# EAGLE schematic v2nixie (EAGLE 9.6.2)
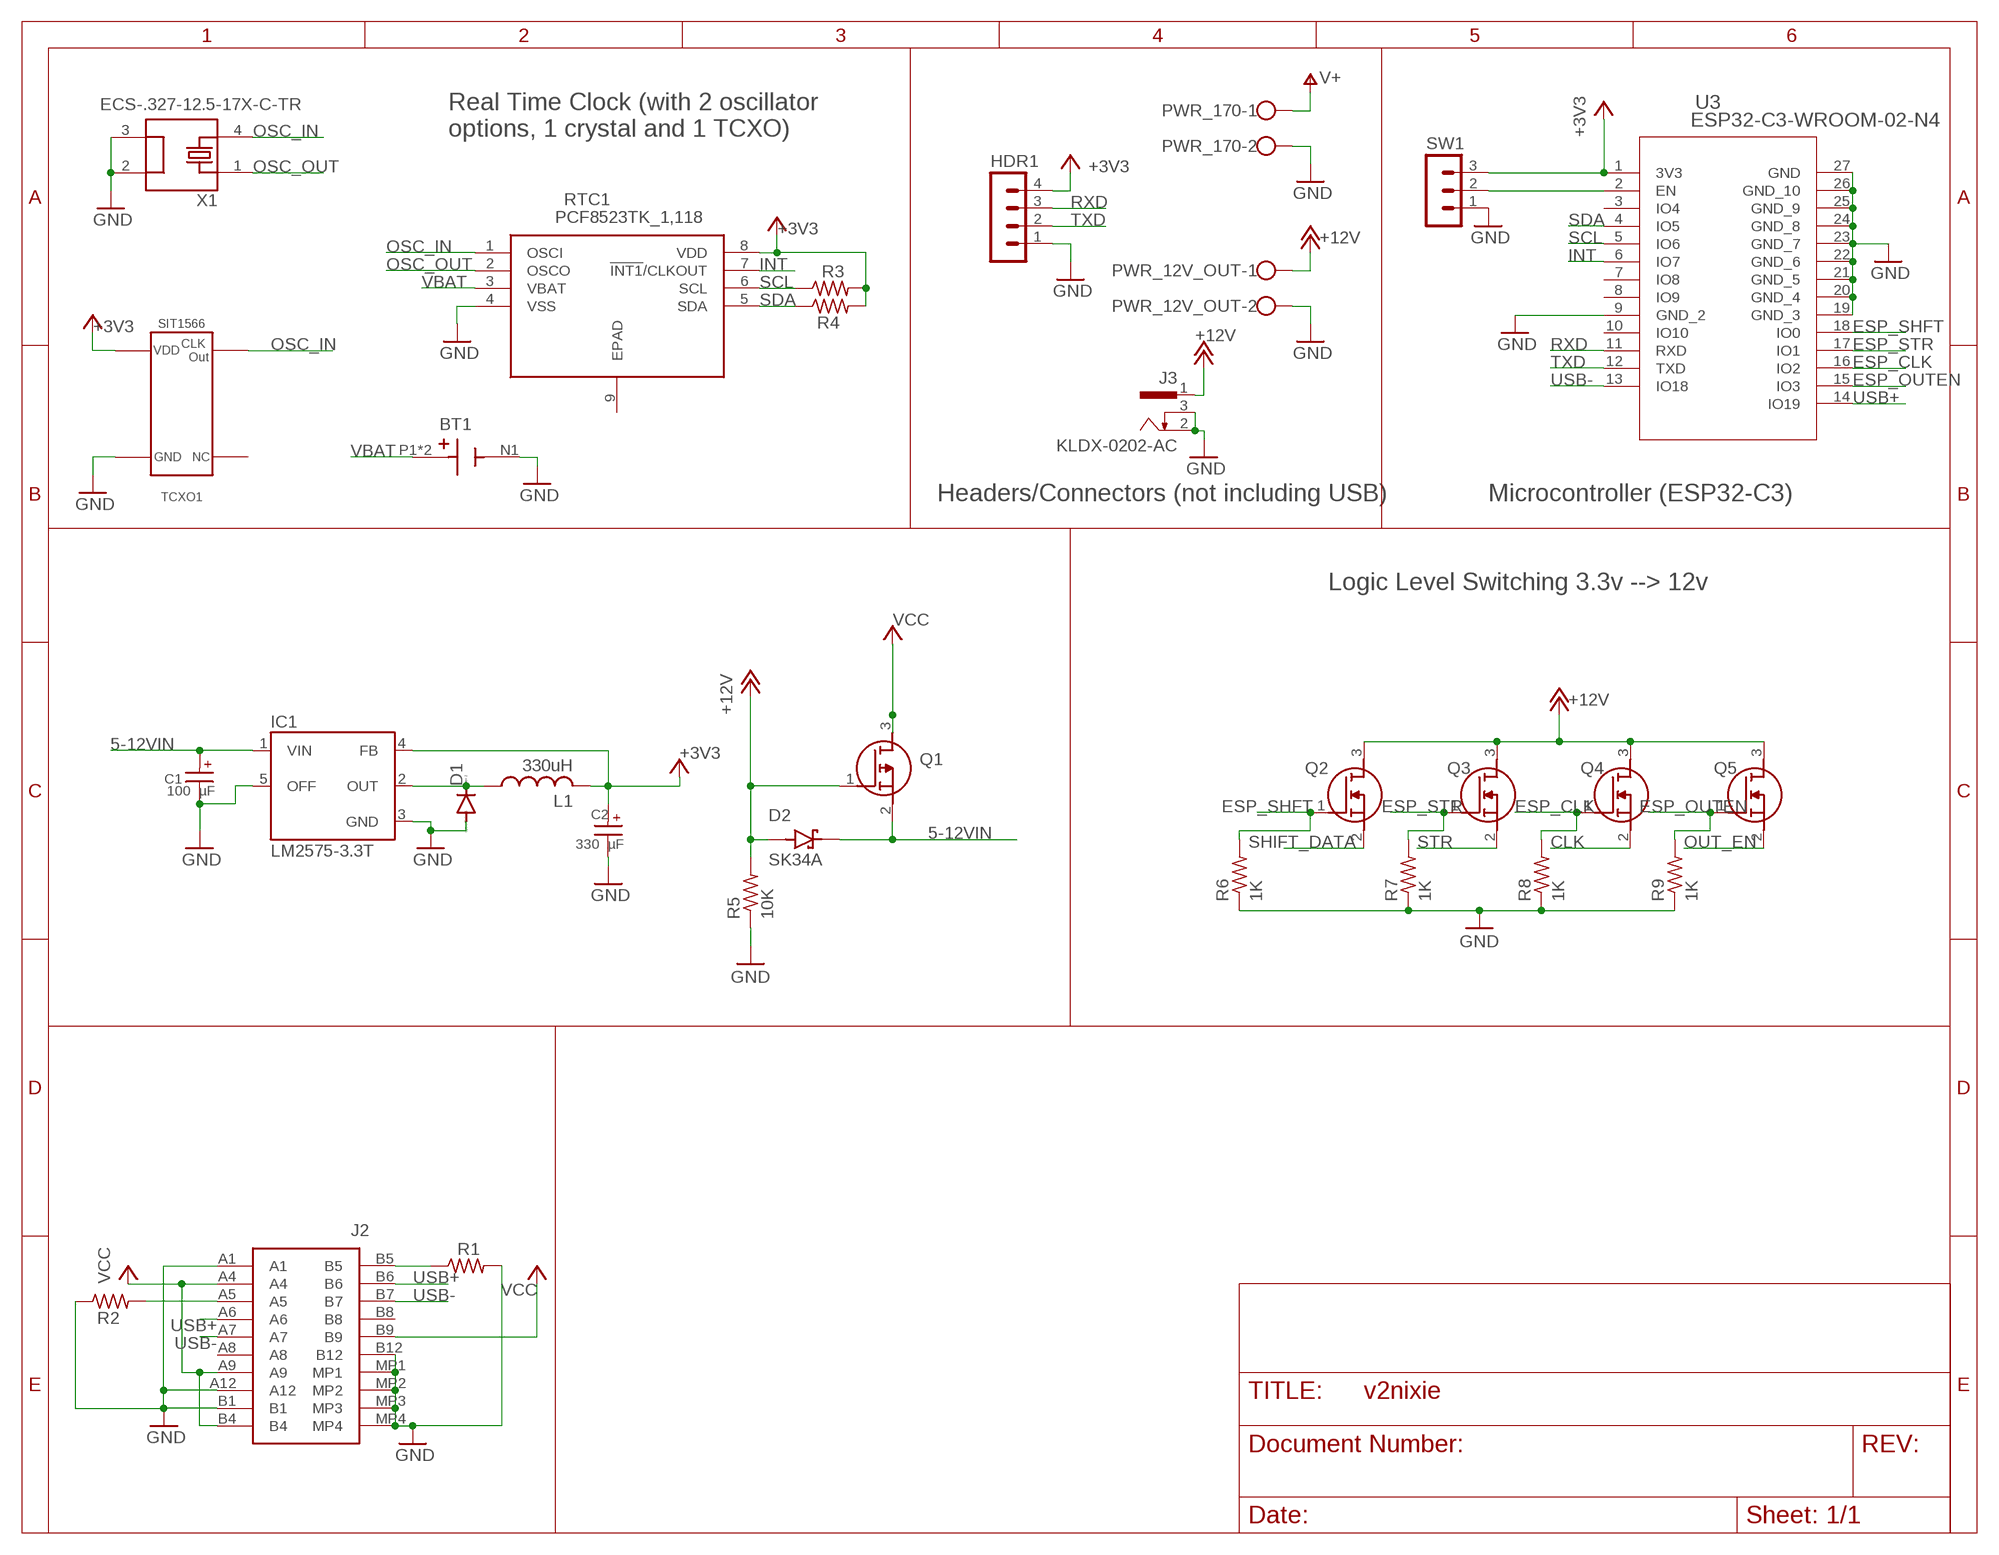
[diagram p0: schematic, sheet 1, part 1 of 2]
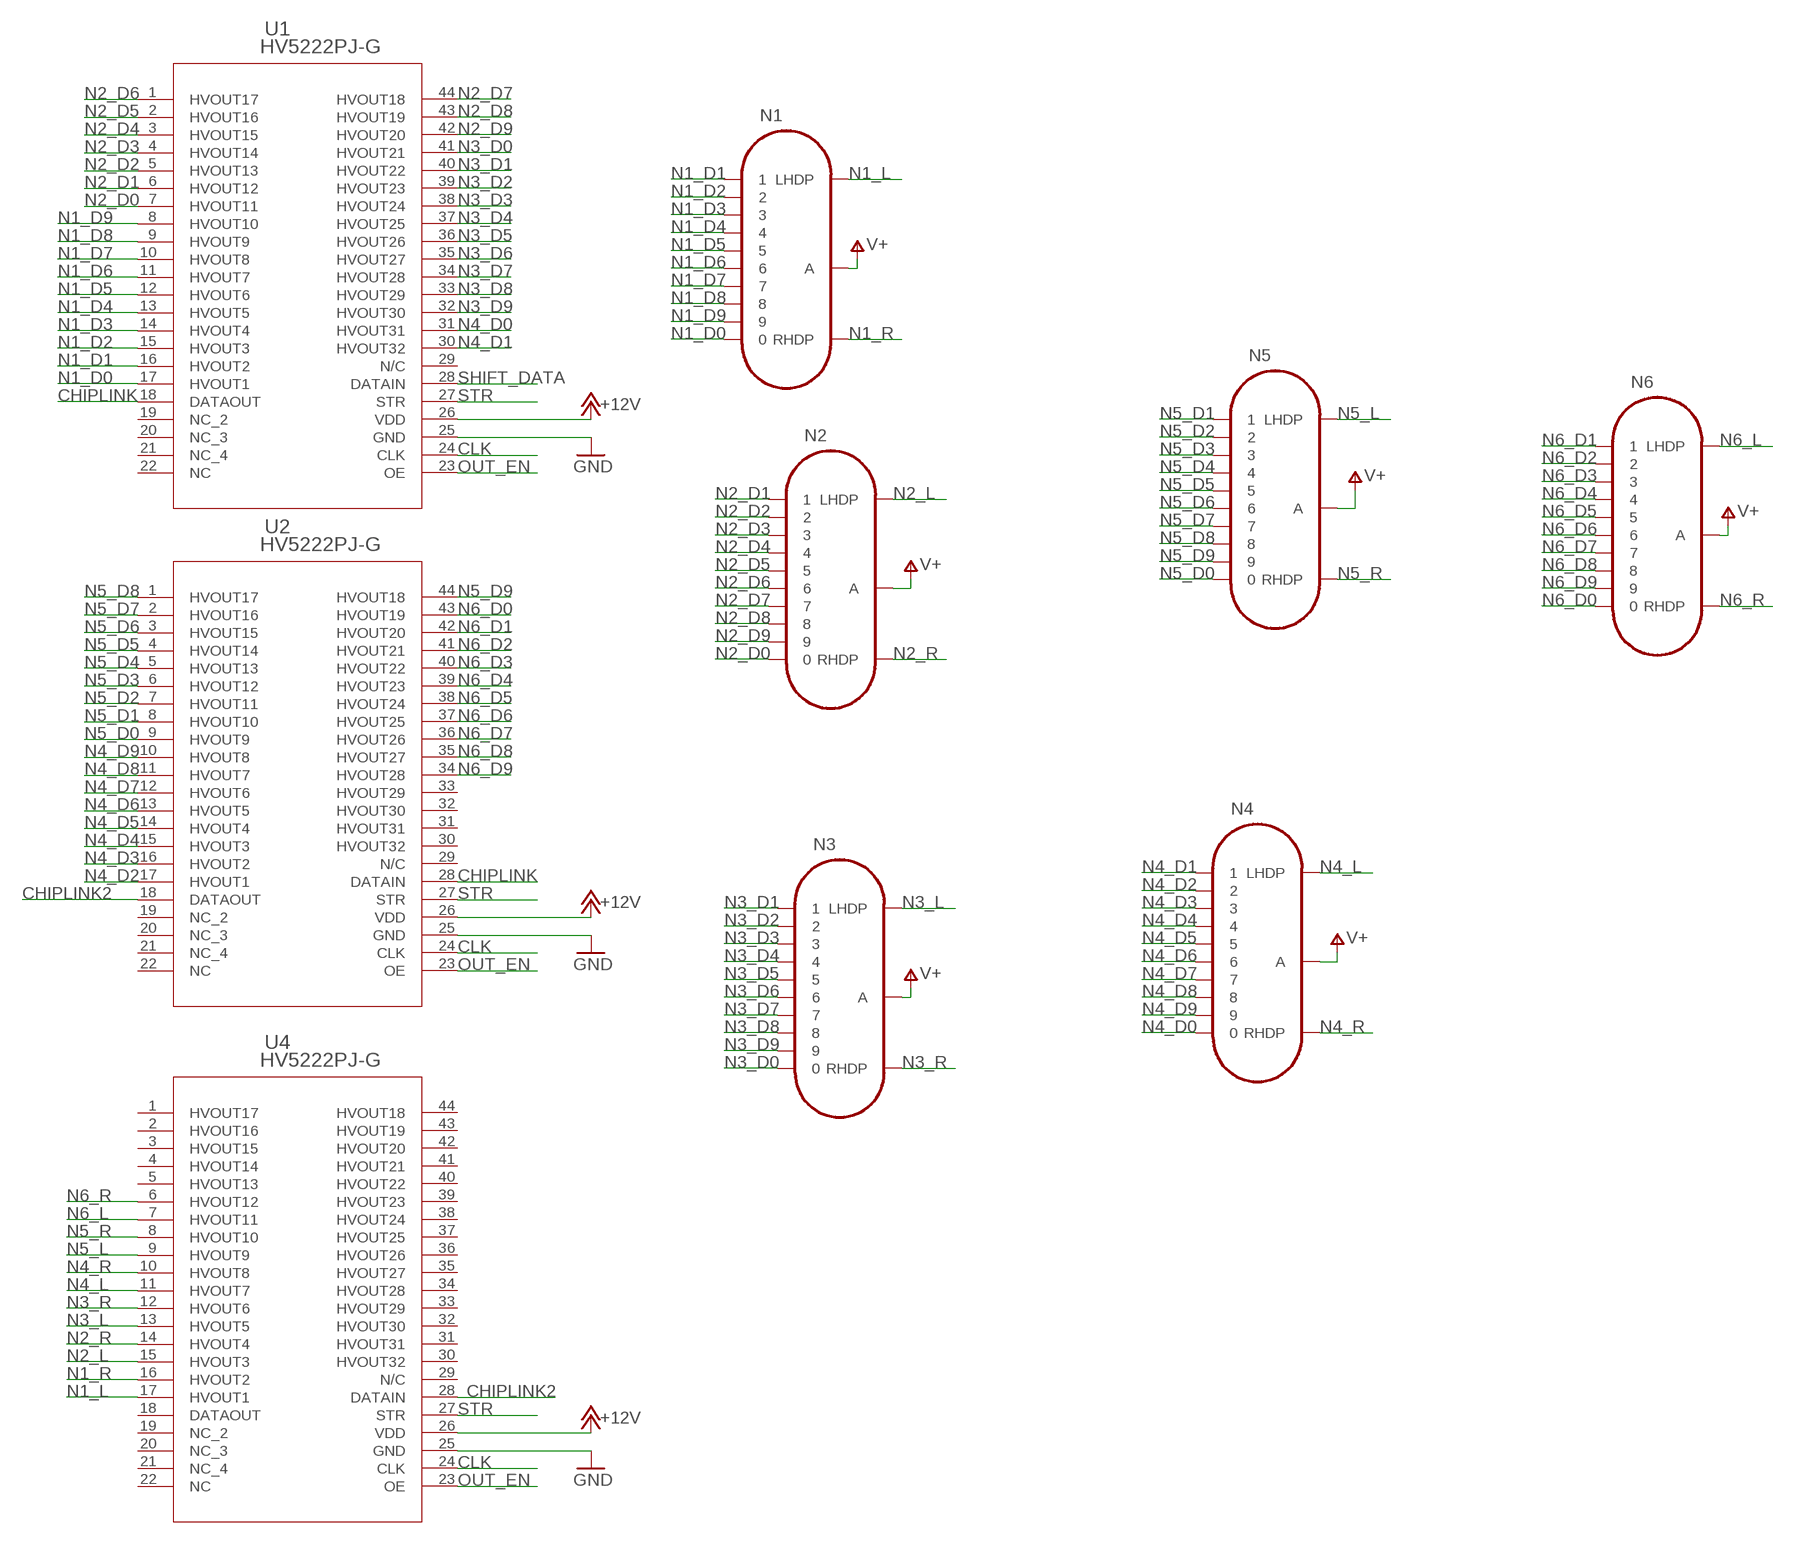
[diagram p1: schematic, sheet 1, part 2 of 2]

## Parts
BT1  BAT-HLD-001-TR  [BAT_BAT-HLD-001-TR]
C1  100 µF  WCAP-PTG5_8X11.5_870025374001  [WCAP-PTG5_8X11.5(DXL)]
C2  330 µF  WCAP-PTG5_8X8_870025174004  [WCAP-PTG5_8X8(DXL)]
D1  DIODE-DO201-15  [DO201-15]
D2  SK34A  [DIOM4325X250N]
HDR1  MA04-1  [MA04-1]
IC1  LM2575-3.3T  [TO220-5]
J2  USB4110-GF-A  [USB4110GFA]
J3  KLDX-0202-AC  [KYCON_KLDX-0202-AC]
L1  330uH  L-US6000-XXX-RC  [6000-XXXX-RC]
N1  IN-14  [IN-14]
N2  IN-14  [IN-14]
N3  IN-14  [IN-14]
N4  IN-14  [IN-14]
N5  IN-14  [IN-14]
N6  IN-14  [IN-14]
PWR_12V_OUT  W237-102  [W237-102]
PWR_170  W237-102  [W237-102]
Q1  SSM3J117TU,LF_T  [SSM3J117TULFT]
Q2  RU1J002YNTCL  [SOTFL65P210X105-3N]
Q3  RU1J002YNTCL  [SOTFL65P210X105-3N]
Q4  RU1J002YNTCL  [SOTFL65P210X105-3N]
Q5  RU1J002YNTCL  [SOTFL65P210X105-3N]
R1  5.1K  R-US_R0805  [R0805]
R2  5.1K  R-US_R0805  [R0805]
R3  10K  R-US_R0805  [R0805]
R4  10K  R-US_R0805  [R0805]
R5  10K  R-US_M0805  [M0805]
R6  1K  R-US_M0805  [M0805]
R7  1K  R-US_M0805  [M0805]
R8  1K  R-US_M0805  [M0805]
R9  1K  R-US_M0805  [M0805]
RTC1  PCF8523TK_1,118  [SON80P400X400X100-9N]
SW1  MA03-1  [MA03-1]
TCXO1  SIT1566  [SIT1566]
U1  HV5222PJ-G  [PLCC44_MC_MCH]
U2  HV5222PJ-G  [PLCC44_MC_MCH]
U3  ESP32-C3-WROOM-02-N4  [IC18_ESP32-C3-WROOM-02-N4_EXP]
U4  HV5222PJ-G  [PLCC44_MC_MCH]
X1  ECS-.327-12.5-17X-C-TR  [XTAL_ECS-.327-12.5-17X-C-TR]

## Nets
5-12VIN: C1.1(+) D2.C(K) IC1.1(VIN) Q1.2(S)
+3V3: C2.1(+) HDR1.4 IC1.4(FB) L1.2 R3.2 R4.2 RTC1.8(VDD) SW1.3 TCXO1.VDD U3.1(3V3)
+12V: D2.A J3.1 PWR_12V_OUT.1 Q1.1(G) Q2.3(D) Q3.3(D) Q4.3(D) Q5.3(D) R5.2 U1.26(VDD) U2.26(VDD) U4.26(VDD)
CHIPLINK: U1.18(DATAOUT) U2.28(DATAIN)
CHIPLINK2: U2.18(DATAOUT) U4.28(DATAIN)
CLK: Q4.2(S) U1.24(CLK) U2.24(CLK) U4.24(CLK)
ESP_CLK: Q4.1(G) R8.2 U3.16(IO2)
ESP_OUTEN: Q5.1(G) R9.2 U3.15(IO3)
ESP_SHFT: Q2.1(G) R6.2 U3.18(IO0)
ESP_STR: Q3.1(G) R7.2 U3.17(IO1)
GND: BT1.N1(-) C1.2(-) C2.2(-) D1.A HDR1.1 IC1.3(GND) IC1.5(OFF) J2.A1 J2.A12 J2.B1 J2.B12 J2.MP1 J2.MP2 J2.MP3 J2.MP4 J3.2 J3.3 PWR_12V_OUT.2 PWR_170.2 R1.2 R2.1 R5.1 R6.1 R7.1 R8.1 R9.1 RTC1.4(VSS) SW1.1 TCXO1.GND U1.25(GND) U2.25(GND) U3.9(GND_2) U3.19(GND_3) U3.20(GND_4) U3.21(GND_5) U3.22(GND_6) U3.23(GND_7) U3.24(GND_8) U3.25(GND_9) U3.26(GND_10) U3.27(GND) U4.25(GND) X1.2 X1.3
INT: RTC1.7(!INT1!/CLKOUT) U3.6(IO7)
N1_D0: N1.0 U1.17(HVOUT1)
N1_D1: N1.1 U1.16(HVOUT2)
N1_D2: N1.2 U1.15(HVOUT3)
N1_D3: N1.3 U1.14(HVOUT4)
N1_D4: N1.4 U1.13(HVOUT5)
N1_D5: N1.5 U1.12(HVOUT6)
N1_D6: N1.6 U1.11(HVOUT7)
N1_D7: N1.7 U1.10(HVOUT8)
N1_D8: N1.8 U1.9(HVOUT9)
N1_D9: N1.9 U1.8(HVOUT10)
N1_L: N1.LHDP U4.17(HVOUT1)
N1_R: N1.RHDP U4.16(HVOUT2)
N2_D0: N2.0 U1.7(HVOUT11)
N2_D1: N2.1 U1.6(HVOUT12)
N2_D2: N2.2 U1.5(HVOUT13)
N2_D3: N2.3 U1.4(HVOUT14)
N2_D4: N2.4 U1.3(HVOUT15)
N2_D5: N2.5 U1.2(HVOUT16)
N2_D6: N2.6 U1.1(HVOUT17)
N2_D7: N2.7 U1.44(HVOUT18)
N2_D8: N2.8 U1.43(HVOUT19)
N2_D9: N2.9 U1.42(HVOUT20)
N2_L: N2.LHDP U4.15(HVOUT3)
N2_R: N2.RHDP U4.14(HVOUT4)
N3_D0: N3.0 U1.41(HVOUT21)
N3_D1: N3.1 U1.40(HVOUT22)
N3_D2: N3.2 U1.39(HVOUT23)
N3_D3: N3.3 U1.38(HVOUT24)
N3_D4: N3.4 U1.37(HVOUT25)
N3_D5: N3.5 U1.36(HVOUT26)
N3_D6: N3.6 U1.35(HVOUT27)
N3_D7: N3.7 U1.34(HVOUT28)
N3_D8: N3.8 U1.33(HVOUT29)
N3_D9: N3.9 U1.32(HVOUT30)
N3_L: N3.LHDP U4.13(HVOUT5)
N3_R: N3.RHDP U4.12(HVOUT6)
N4_D0: N4.0 U1.31(HVOUT31)
N4_D1: N4.1 U1.30(HVOUT32)
N4_D2: N4.2 U2.17(HVOUT1)
N4_D3: N4.3 U2.16(HVOUT2)
N4_D4: N4.4 U2.15(HVOUT3)
N4_D5: N4.5 U2.14(HVOUT4)
N4_D6: N4.6 U2.13(HVOUT5)
N4_D7: N4.7 U2.12(HVOUT6)
N4_D8: N4.8 U2.11(HVOUT7)
N4_D9: N4.9 U2.10(HVOUT8)
N4_L: N4.LHDP U4.11(HVOUT7)
N4_R: N4.RHDP U4.10(HVOUT8)
N5_D0: N5.0 U2.9(HVOUT9)
N5_D1: N5.1 U2.8(HVOUT10)
N5_D2: N5.2 U2.7(HVOUT11)
N5_D3: N5.3 U2.6(HVOUT12)
N5_D4: N5.4 U2.5(HVOUT13)
N5_D5: N5.5 U2.4(HVOUT14)
N5_D6: N5.6 U2.3(HVOUT15)
N5_D7: N5.7 U2.2(HVOUT16)
N5_D8: N5.8 U2.1(HVOUT17)
N5_D9: N5.9 U2.44(HVOUT18)
N5_L: N5.LHDP U4.9(HVOUT9)
N5_R: N5.RHDP U4.8(HVOUT10)
N6_D0: N6.0 U2.43(HVOUT19)
N6_D1: N6.1 U2.42(HVOUT20)
N6_D2: N6.2 U2.41(HVOUT21)
N6_D3: N6.3 U2.40(HVOUT22)
N6_D4: N6.4 U2.39(HVOUT23)
N6_D5: N6.5 U2.38(HVOUT24)
N6_D6: N6.6 U2.37(HVOUT25)
N6_D7: N6.7 U2.36(HVOUT26)
N6_D8: N6.8 U2.35(HVOUT27)
N6_D9: N6.9 U2.34(HVOUT28)
N6_L: N6.LHDP U4.7(HVOUT11)
N6_R: N6.RHDP U4.6(HVOUT12)
N$1: J2.A5 R2.2
N$2: SW1.2 U3.2(EN)
N$3: J2.B5 R1.1
N$5: D1.C IC1.2(OUT) L1.1
OSC_IN: RTC1.1(OSCI) TCXO1.CLK_OUT X1.4
OSC_OUT: RTC1.2(OSCO) X1.1
OUT_EN: Q5.2(S) U1.23(OE) U2.23(OE) U4.23(OE)
RXD: HDR1.3 U3.11(RXD)
SCL: R3.1 RTC1.6(SCL) U3.5(IO6)
SDA: R4.1 RTC1.5(SDA) U3.4(IO5)
SHIFT_DATA: Q2.2(S) U1.28(DATAIN)
STR: Q3.2(S) U1.27(STR) U2.27(STR) U4.27(STR)
TXD: HDR1.2 U3.12(TXD)
USB+: J2.A6 J2.B6 U3.14(IO19)
USB-: J2.A7 J2.B7 U3.13(IO18)
V+: N1.A N2.A N3.A N4.A N5.A N6.A PWR_170.1
VBAT: BT1.P1(+) BT1.P2(+) RTC1.3(VBAT)
VCC: J2.A4 J2.A9 J2.B4 J2.B9 Q1.3(D)
Unconnected: J2.A8 J2.B8 RTC1.9(EPAD) TCXO1.NC U1.19(NC_2) U1.20(NC_3) U1.21(NC_4) U1.22(NC) U1.29(N/C) U2.19(NC_2) U2.20(NC_3) U2.21(NC_4) U2.22(NC) U2.29(N/C) U2.30(HVOUT32) U2.31(HVOUT31) U2.32(HVOUT30) U2.33(HVOUT29) U3.3(IO4) U3.7(IO8) U3.8(IO9) U3.10(IO10) U4.1(HVOUT17) U4.2(HVOUT16) U4.3(HVOUT15) U4.4(HVOUT14) U4.5(HVOUT13) U4.18(DATAOUT) U4.19(NC_2) U4.20(NC_3) U4.21(NC_4) U4.22(NC) U4.29(N/C) U4.30(HVOUT32) U4.31(HVOUT31) U4.32(HVOUT30) U4.33(HVOUT29) U4.34(HVOUT28) U4.35(HVOUT27) U4.36(HVOUT26) U4.37(HVOUT25) U4.38(HVOUT24) U4.39(HVOUT23) U4.40(HVOUT22) U4.41(HVOUT21) U4.42(HVOUT20) U4.43(HVOUT19) U4.44(HVOUT18)

## Notes on the sheet
- Real Time Clock (with 2 oscillator 
  options, 1 crystal and 1 TCXO)
- Headers/Connectors (not including USB) | Microcontroller (ESP32-C3)
- Logic Level Switching 3.3v --> 12v

## Library data of the parts
BT1 = BAT-HLD-001-TR:BAT-HLD-001-TR: Battery Retainer Coin, 20.0mm 1 Cell SMD (SMT) Tab; DESCRIPTION: Holder for CR2032 and CR2025 Batteries, Surface-Mount, Tape and Reel Packaging; DIGI-KEY_PART_NUMBER: BAT-HLD-001-TRTR-ND; MF: Linx Technologies; MP: BAT-HLD-001-TR; PACKAGE: None; PURCHASE-URL: https://pricing.snapeda.com/search/part/BAT-HLD-001-TR/?ref=eda
C1 = Wurth_Capacitors_WCAP-PTG5:WCAP-PTG5_8X11.5: WCAP-PTG5 Aluminium Polymer Capacitors General Purpose +105 °C Characteristics General purpose product series with max. operating temperature of +105 °C Low ESR over high frequency range High permissible ripple current Mounting style: THT Radial Capacitance range: 39 µF ‒ 2000 µF Capacitance tolerance: ±20 % Voltage range (UR): 6.3 ‒ 25 V(DC) Operating temperature: -55 °C up to +105 °C Endurance: 2000h @ +105 °C Dimensions (DxL) in mm: 8.0 x 8.0 up to 10.0 x 12.5 Recommended soldering: Wave soldering Applications Low ripple voltage at the switching converter Filtering Smoothing Coupling e.g. High-end power supply, industrial computer, VGA card, charger, digital set-top box <https://www.we-online.com/catalog/media/o14739v209%20Family_WCAP-PTG5.jpg> Details see: https://www.we-online.com/catalog/en/WCAP-PTG5/ Updated by yingchun,Shan;2020-03-05 2020(C) Würth Elektronik; DATASHEET-URL: https://www.we-online.com/catalog/datasheet/870025374001.pdf; DF: 8%; DIAMETER: 8mm; I-LEAK: 160uA; I-RIPPLE: 4800mA; L: 11.5mm; OPERATING-TEMPERATURE: -55 °C up to +105 °C; PART-NUMBER: 870025374001; PITCH: 3.5mm; TECHNICAL-REFERENCE: PTEE115101M016DSPA7B000; VR: 16V(DC)
C2 = Wurth_Capacitors_WCAP-PTG5:WCAP-PTG5_8X8: WCAP-PTG5 Aluminium Polymer Capacitors General Purpose +105 °C Characteristics General purpose product series with max. operating temperature of +105 °C Low ESR over high frequency range High permissible ripple current Mounting style: THT Radial Capacitance range: 39 µF ‒ 2000 µF Capacitance tolerance: ±20 % Voltage range (UR): 6.3 ‒ 25 V(DC) Operating temperature: -55 °C up to +105 °C Endurance: 2000h @ +105 °C Dimensions (DxL) in mm: 8.0 x 8.0 up to 10.0 x 12.5 Recommended soldering: Wave soldering Applications Low ripple voltage at the switching converter Filtering Smoothing Coupling e.g. High-end power supply, industrial computer, VGA card, charger, digital set-top box <https://www.we-online.com/catalog/media/o14739v209%20Family_WCAP-PTG5.jpg> Details see: https://www.we-online.com/catalog/en/WCAP-PTG5/ Updated by yingchun,Shan;2020-03-05 2020(C) Würth Elektronik; DATASHEET-URL: https://www.we-online.com/catalog/datasheet/870025174004.pdf; DF: 7%; DIAMETER: 8mm; I-LEAK: 416uA; I-RIPPLE: 5100mA; L: 8mm; OPERATING-TEMPERATURE: -55 °C up to +105 °C; PART-NUMBER: 870025174004; PITCH: 3.5mm; TECHNICAL-REFERENCE: PTEE080331M6R3DSPA7B000; VR: 6.3V(DC)
D1 = diode:DIODE-: DIODE
D2 = SK34A:SK34A; DESCRIPTION: 3A, 40V, Schottky Rectifier; MF: Taiwan Semiconductor; MP: SK34A-T; PACKAGE: None; PURCHASE-URL: https://pricing.snapeda.com/search/part/SK34A-T/?ref=eda
HDR1 = con-lstb:MA04-1: PIN HEADER; OC_FARNELL: unknown; OC_NEWARK: unknown
IC1 = lm2575:LM2575-3.3: National Semiconductor <http://www.national.com> 1.0A "Simple Switcher"(c) 52kHz, Vout 1.23-37V (HV: 57V), Vin 40V (HV: 60V), 50µA standby current
J2 = SamacSys_Parts:USB4110-GF-A: CONN USB 2.0 TYPE-C R/A SMT Source: Datasheet <https://gct.co/files/drawings/usb4110.pdf>; DESCRIPTION: CONN USB 2.0 TYPE-C R/A SMT; HEIGHT: 3.26mm; MANUFACTURER_NAME: GCT (GLOBAL CONNECTOR TECHNOLOGY); MANUFACTURER_PART_NUMBER: USB4110-GF-A; MOUSER_PART_NUMBER: 640-USB4110-GF-A; MOUSER_PRICE-STOCK: https://www.mouser.co.uk/ProductDetail/GCT/USB4110-GF-A?qs=KUoIvG%2F9IlYiZvIXQjyJeA%3D%3D
J3 = KLDX-0202-AC:KLDX-0202-AC: Conn Power PIN 2 POS Solder RA Thru-Hole 3 Terminal 1 Port; DESCRIPTION: Power Barrel Connector Jack 2.00mm ID (0.079), 5.50mm OD (0.217) Through Hole, Right Angle; DIGI-KEY_PART_NUMBER: 2092-KLDX-0202-AC-ND; MF: Kycon; MP: KLDX-0202-AC; PACKAGE: None; PURCHASE-URL: https://pricing.snapeda.com/search/part/KLDX-0202-AC/?ref=eda
L1 = rcl:L-US: INDUCTOR, American symbol; SPICEPREFIX: L
N1-N6 = nixies-us:IN-14: IN-14: medium numeric frontview nixie tube
PWR_12V_OUT PWR_170 = con-wago-500:W237-102: WAGO SCREW CLAMP; MPN: 237-102; OC_FARNELL: unknown; OC_NEWARK: 70K9898; SPICEPREFIX: X
Q1 = SamacSys_Parts:SSM3J117TU,LF_T: P-Channel 30 V 2A (Ta) 500mW (Ta) Surface Mount UFM Source: Datasheet <https://toshiba.semicon-storage.com/ap-en/semiconductor/product/mosfets/detail.SSM3J117TU.html>; DESCRIPTION: P-Channel 30 V 2A (Ta) 500mW (Ta) Surface Mount UFM; HEIGHT: 0.75mm; MANUFACTURER_NAME: Toshiba; MANUFACTURER_PART_NUMBER: SSM3J117TU,LF(T
Q2-Q5 = SamacSys_Parts:RU1J002YNTCL: MOSFET,N-channel,50V,200mA,SOT323FL Source: Datasheet; DESCRIPTION: MOSFET,N-channel,50V,200mA,SOT323FL; HEIGHT: 1.05mm; MANUFACTURER_NAME: ROHM Semiconductor; MANUFACTURER_PART_NUMBER: RU1J002YNTCL; MOUSER_PART_NUMBER: 755-RU1J002YNTCL; MOUSER_PRICE-STOCK: https://www.mouser.co.uk/ProductDetail/ROHM-Semiconductor/RU1J002YNTCL?qs=npTsUczJOtM%2FefBcq0SyrQ%3D%3D
R1-R4 = rcl:R-US_: RESISTOR, American symbol; SPICEPREFIX: R
R5-R9 = resistor:R-US_: RESISTOR, American symbol
RTC1 = SamacSys_Parts:PCF8523TK_1,118: Real Time Clock Serial Clock/Calendar/Alarm/Timer/Battery Backup 8-Pin HVSON EP T/R Source: Datasheet <http://www.nxp.com/docs/en/data-sheet/PCF8523.pdf>; DESCRIPTION: Real Time Clock Serial Clock/Calendar/Alarm/Timer/Battery Backup 8-Pin HVSON EP T/R; HEIGHT: 1mm; MANUFACTURER_NAME: NXP; MANUFACTURER_PART_NUMBER: PCF8523TK/1,118; MOUSER_PART_NUMBER: 771-PCF8523TK/1118; MOUSER_PRICE-STOCK: https://www.mouser.co.uk/ProductDetail/NXP-Semiconductors/PCF8523TK-1118?qs=beN0Cyoe8Ym%252Bv1xGDkWHJQ%3D%3D
SW1 = con-lstb:MA03-1: PIN HEADER; OC_FARNELL: unknown; OC_NEWARK: unknown
TCXO1 = SIT1566_TCXO:SIT1566
U1 U2 U4 = HV5222PJ-G:HV5222PJ-G; COPYRIGHT: Copyright (C) 2022 Ultra Librarian. All rights reserved.; DIGI-KEY_PART_NUMBER_1: HV5222PJ-G-ND; MANUFACTURER_PART_NUMBER: HV5222PJ-G; MFR_NAME: Microchip
U3 = ul_ESP32-C3-WROOM-02-N4:ESP32-C3-WROOM-02-N4; COPYRIGHT: Copyright (C) 2022 Ultra Librarian. All rights reserved.; DIGI-KEY_PART_NUMBER_1: 1965-ESP32-C3-WROOM-02-N4TR-ND; DIGI-KEY_PART_NUMBER_2: 1965-ESP32-C3-WROOM-02-N4CT-ND; DIGI-KEY_PART_NUMBER_3: 1965-ESP32-C3-WROOM-02-N4DKR-ND; MANUFACTURER_PART_NUMBER: ESP32-C3-WROOM-02-N4; MFR_NAME: Espressif Systems
X1 = ECS-.327-12.5-17X-C-TR:ECS-.327-12.5-17X-C-TR: Crystal 4-SOJ, 5.50mm pitch; DESCRIPTION: 32.768 kHz ±10ppm Crystal 12.5pF 50 kOhms 4-SOJ, 5.50mm pitch; DIGI-KEY_PART_NUMBER: XC1912TR-ND; MF: ECS Inc.; MP: ECS-.327-12.5-17X-C-TR; PACKAGE: 4-4 ECS International; PURCHASE-URL: https://pricing.snapeda.com/search/part/ECS-.327-12.5-17X-C-TR/?ref=eda